# Altium project ALU_Shifter.PrjPcb
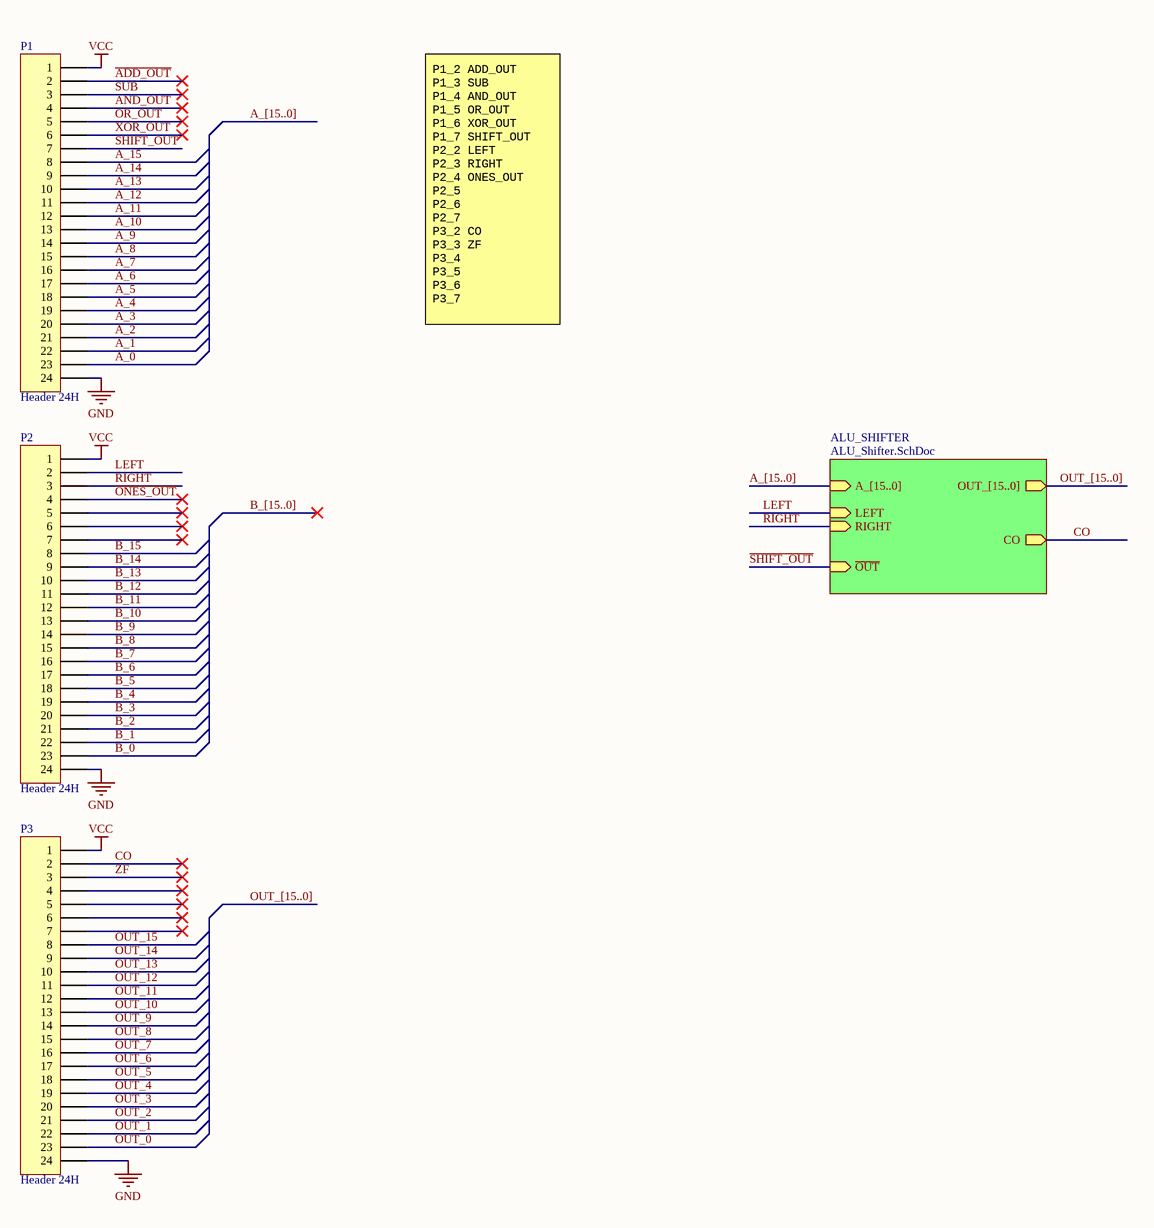
[diagram p0: Connectors.SchDoc]
2 sheets, 17 parts. Net scope: hierarchical (ports join the sheet entries above them; power ports are global).
Board file: ALU_Shifter.PcbDoc
Sheets:
  Connectors.SchDoc
    ALU_SHIFTER = ALU_Shifter.SchDoc

## Sheet Connectors.SchDoc
size B; Author: E. Sims; Organization: Let's Build Rockets Inc.; SheetNumber: 1; SheetTotal: 2

### Parts
P1  Header 24H  [HDR1X24H]
P2  Header 24H  [HDR1X24H]
P3  Header 24H  [HDR1X24H]

### Sub-sheets
ALU_SHIFTER = ALU_Shifter.SchDoc: ~{OUT} (in), OUT_[15..0] (out), A_[15..0] (in), CO (out), LEFT (in), RIGHT (in)

### Nets
GND: P1.24 P2.24 P3.24
VCC: P1.1 P2.1 P3.1
~{ADD_OUT}: P1.2
~{AND_OUT}: P1.4
A_0: P1.23
A_1: P1.22
A_2: P1.21
A_3: P1.20
A_4: P1.19
A_5: P1.18
A_6: P1.17
A_7: P1.16
A_8: P1.15
A_9: P1.14
A_10: P1.13
A_11: P1.12
A_12: P1.11
A_13: P1.10
A_14: P1.9
A_15: P1.8
B_0: P2.23
B_1: P2.22
B_2: P2.21
B_3: P2.20
B_4: P2.19
B_5: P2.18
B_6: P2.17
B_7: P2.16
B_8: P2.15
B_9: P2.14
B_10: P2.13
B_11: P2.12
B_12: P2.11
B_13: P2.10
B_14: P2.9
B_15: P2.8
CO: P3.2 ; sheet ALU_SHIFTER/CO
LEFT: P2.2 ; sheet ALU_SHIFTER/LEFT
~{ONES_OUT}: P2.4
~{OR_OUT}: P1.5
OUT_0: P3.23
OUT_1: P3.22
OUT_2: P3.21
OUT_3: P3.20
OUT_4: P3.19
OUT_5: P3.18
OUT_6: P3.17
OUT_7: P3.16
OUT_8: P3.15
OUT_9: P3.14
OUT_10: P3.13
OUT_11: P3.12
OUT_12: P3.11
OUT_13: P3.10
OUT_14: P3.9
OUT_15: P3.8
RIGHT: P2.3 ; sheet ALU_SHIFTER/RIGHT
~{SHIFT_OUT}: P1.7 ; sheet ALU_SHIFTER/~{OUT}  [project net ~{OUT}]
SUB: P1.3
~{XOR_OUT}: P1.6
~{ZF}: P3.3

Not connected (* = marked no-connect by the designer): P2 5* 6* 7*; P3 4* 5* 6* 7*

### Buses and harness runs
bus A_[15..0]
bus A_[15..0] = sheet ALU_SHIFTER/A_[15..0]
bus B_[15..0]
bus OUT_[15..0]
bus OUT_[15..0] = sheet ALU_SHIFTER/OUT_[15..0]

### Notes on the sheet
- P1_2 ADD_OUT
  P1_3 SUB
  P1_4 AND_OUT
  P1_5 OR_OUT
  P1_6 XOR_OUT
  P1_7 SHIFT_OUT
  P2_2 LEFT
  P2_3 RIGHT
  P2_4 ONES_OUT
  P2_5
  P2_6
  P2_7
  P3_2 CO
  P3_3 ZF
  P3_4
  P3_5
  P3_6
  P3_7
- Let's Build Rocket's Inc. Modular Paylaod System Based on TMP-010 Rev
  For more information visit https://github.com/LetsBuildRockets/Modular-Payload-System
  This work is licensed under CC BY-NC 4.0. To view a copy of this license, visit https://creativecommons.org/licenses/by-nc/4.0
- Title
- Size:
- Date:
- Assembly Variant:
- B
- Number:
- Time:
- Revision:
- Sheet
- of
- Author:
- File:

### Library data of the parts
P1-P3 = Header 24H: Header, 24-Pin, Right Angle; LatestRevisionDate: 17-Jul-2002; LatestRevisionNote: Re-released for DXP Platform.; Publisher: Altium Limited

## Sheet ALU_Shifter.SchDoc
size B; Author: E. Sims; Organization: Let's Build Rockets Inc.; SheetNumber: 15; SheetTotal: 16
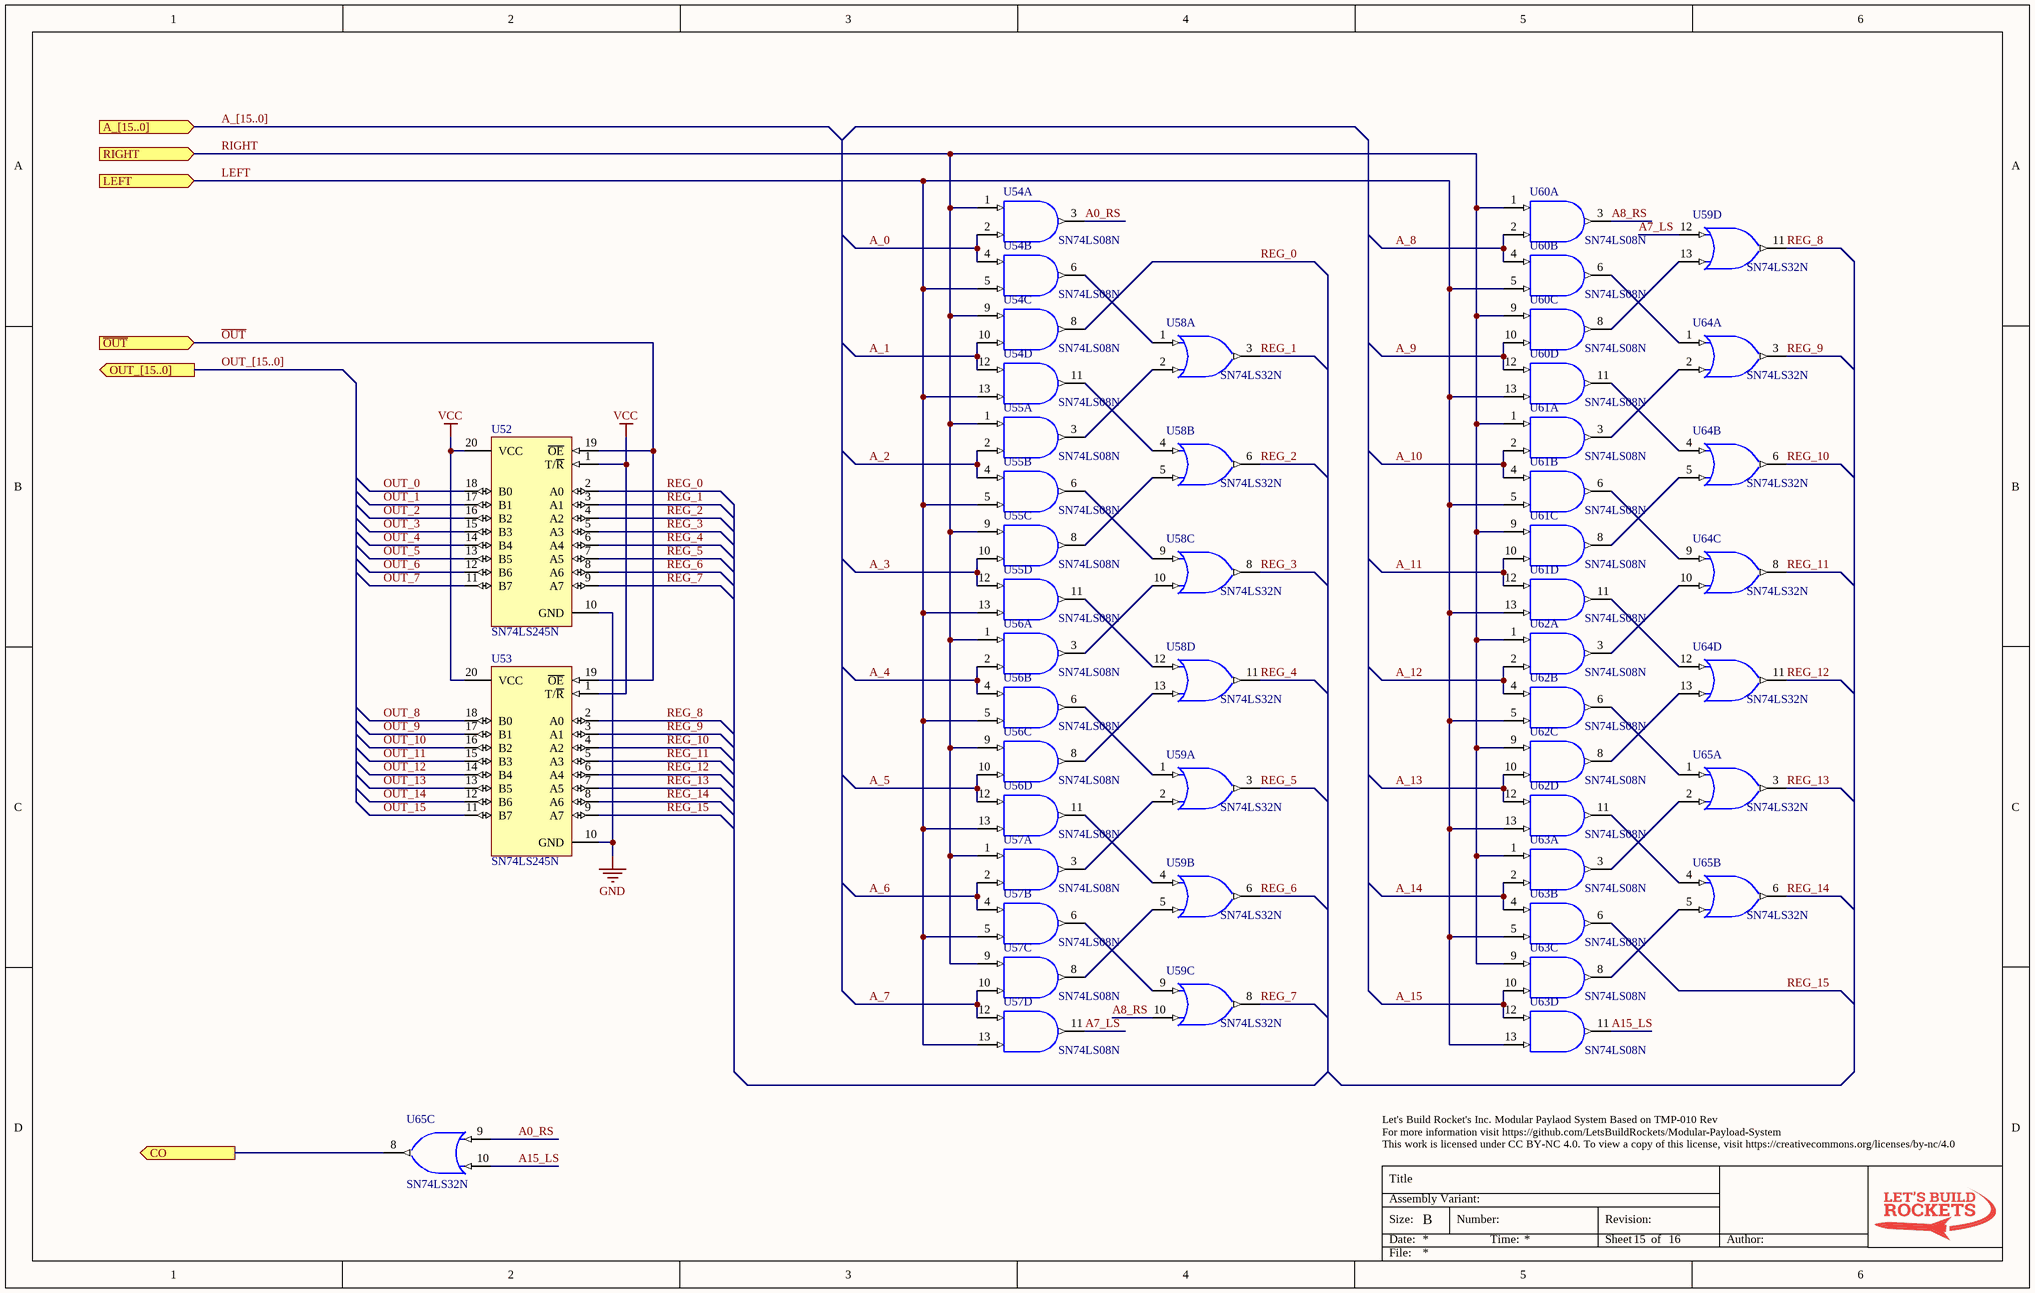
[diagram p1: ALU_Shifter.SchDoc]

### Parts
U52  SN74LS245N  [N020]
U53  SN74LS245N  [N020]
U54  SN74LS08N  [N014]  (parts A,B,C,D of 4)
U55  SN74LS08N  [N014]  (parts A,B,C,D of 4)
U56  SN74LS08N  [N014]  (parts A,B,C,D of 4)
U57  SN74LS08N  [N014]  (parts A,B,C,D of 4)
U58  SN74LS32N  [N014]  (parts A,B,C,D of 4)
U59  SN74LS32N  [N014]  (parts A,B,C,D of 4)
U60  SN74LS08N  [N014]  (parts A,B,C,D of 4)
U61  SN74LS08N  [N014]  (parts A,B,C,D of 4)
U62  SN74LS08N  [N014]  (parts A,B,C,D of 4)
U63  SN74LS08N  [N014]  (parts A,B,C,D of 4)
U64  SN74LS32N  [N014]  (parts A,B,C,D of 4)
U65  SN74LS32N  [N014]  (parts A,B,C of 4)

### Ports
A_[15..0] (in), CO (out), LEFT (in), OUT_[15..0] (out), RIGHT (in), ~{OUT} (in)

### Nets
GND: U52.10(GND) U53.10(GND) U54.7(GND) U55.7(GND) U56.7(GND) U57.7(GND) U58.7(GND) U59.7(GND) U60.7(GND) U61.7(GND) U62.7(GND) U63.7(GND) U64.7(GND) U65.7(GND)
VCC: U52.1(T/~{R}) U52.20(VCC) U53.1(T/~{R}) U53.20(VCC) U54.14(VCC) U55.14(VCC) U56.14(VCC) U57.14(VCC) U58.14(VCC) U59.14(VCC) U60.14(VCC) U61.14(VCC) U62.14(VCC) U63.14(VCC) U64.14(VCC) U65.14(VCC)
A0_RS: U54.3(Y) U65.9(A)
A7_LS: U57.11(Y) U59.12(A)
A8_RS: U59.10(B) U60.3(Y)
A15_LS: U63.11(Y) U65.10(B)
A_0: U54.2(B) U54.4(A)
A_1: U54.10(B) U54.12(A)
A_2: U55.2(B) U55.4(A)
A_3: U55.10(B) U55.12(A)
A_4: U56.2(B) U56.4(A)
A_5: U56.10(B) U56.12(A)
A_6: U57.2(B) U57.4(A)
A_7: U57.10(B) U57.12(A)
A_8: U60.2(B) U60.4(A)
A_9: U60.10(B) U60.12(A)
A_10: U61.2(B) U61.4(A)
A_11: U61.10(B) U61.12(A)
A_12: U62.2(B) U62.4(A)
A_13: U62.10(B) U62.12(A)
A_14: U63.2(B) U63.4(A)
A_15: U63.10(B) U63.12(A)
CO: U65.8(Y) ; port CO
LEFT: U54.5(B) U54.13(B) U55.5(B) U55.13(B) U56.5(B) U56.13(B) U57.5(B) U57.13(B) U60.5(B) U60.13(B) U61.5(B) U61.13(B) U62.5(B) U62.13(B) U63.5(B) U63.13(B) ; port LEFT
~{OUT}: U52.19(~{OE}) U53.19(~{OE}) ; port ~{OUT}
OUT_0: U52.18(B0)
OUT_1: U52.17(B1)
OUT_2: U52.16(B2)
OUT_3: U52.15(B3)
OUT_4: U52.14(B4)
OUT_5: U52.13(B5)
OUT_6: U52.12(B6)
OUT_7: U52.11(B7)
OUT_8: U53.18(B0)
OUT_9: U53.17(B1)
OUT_10: U53.16(B2)
OUT_11: U53.15(B3)
OUT_12: U53.14(B4)
OUT_13: U53.13(B5)
OUT_14: U53.12(B6)
OUT_15: U53.11(B7)
REG_0: U52.2(A0) U54.8(Y)
REG_1: U52.3(A1) U58.3(Y)
REG_2: U52.4(A2) U58.6(Y)
REG_3: U52.5(A3) U58.8(Y)
REG_4: U52.6(A4) U58.11(Y)
REG_5: U52.7(A5) U59.3(Y)
REG_6: U52.8(A6) U59.6(Y)
REG_7: U52.9(A7) U59.8(Y)
REG_8: U53.2(A0) U59.11(Y)
REG_9: U53.3(A1) U64.3(Y)
REG_10: U53.4(A2) U64.6(Y)
REG_11: U53.5(A3) U64.8(Y)
REG_12: U53.6(A4) U64.11(Y)
REG_13: U53.7(A5) U65.3(Y)
REG_14: U53.8(A6) U65.6(Y)
REG_15: U53.9(A7) U63.6(Y)
RIGHT: U54.1(A) U54.9(A) U55.1(A) U55.9(A) U56.1(A) U56.9(A) U57.1(A) U57.9(A) U60.1(A) U60.9(A) U61.1(A) U61.9(A) U62.1(A) U62.9(A) U63.1(A) U63.9(A) ; port RIGHT
NetU54_6: U54.6(Y) U58.1(A)
NetU54_11: U54.11(Y) U58.4(A)
NetU55_3: U55.3(Y) U58.2(B)
NetU55_6: U55.6(Y) U58.9(A)
NetU55_8: U55.8(Y) U58.5(B)
NetU55_11: U55.11(Y) U58.12(A)
NetU56_3: U56.3(Y) U58.10(B)
NetU56_6: U56.6(Y) U59.1(A)
NetU56_8: U56.8(Y) U58.13(B)
NetU56_11: U56.11(Y) U59.4(A)
NetU57_3: U57.3(Y) U59.2(B)
NetU57_6: U57.6(Y) U59.9(A)
NetU57_8: U57.8(Y) U59.5(B)
NetU59_13: U59.13(B) U60.8(Y)
NetU60_6: U60.6(Y) U64.1(A)
NetU60_11: U60.11(Y) U64.4(A)
NetU61_3: U61.3(Y) U64.2(B)
NetU61_6: U61.6(Y) U64.9(A)
NetU61_8: U61.8(Y) U64.5(B)
NetU61_11: U61.11(Y) U64.12(A)
NetU62_3: U62.3(Y) U64.10(B)
NetU62_6: U62.6(Y) U65.1(A)
NetU62_8: U62.8(Y) U64.13(B)
NetU62_11: U62.11(Y) U65.4(A)
NetU63_3: U63.3(Y) U65.2(B)
NetU63_8: U63.8(Y) U65.5(B)

### Buses and harness runs
bus A_[15..0] = port A_[15..0]
bus OUT_[15..0] = port OUT_[15..0]

### Notes on the sheet
- Let's Build Rocket's Inc. Modular Paylaod System Based on TMP-010 Rev
  For more information visit https://github.com/LetsBuildRockets/Modular-Payload-System
  This work is licensed under CC BY-NC 4.0. To view a copy of this license, visit https://creativecommons.org/licenses/by-nc/4.0
- Title
- Size:
- Date:
- Assembly Variant:
- B
- Number:
- Time:
- Revision:
- Sheet
- of
- Author:
- File:

### Library data of the parts
U52 U53 = SN74LS245N: Octal Bus Transceiver with 3-State Outputs; Published: 8-Jun-2000; LatestRevisionDate: 04-Mar-2005; LatestRevisionNote: Stylized 3D Model Added.; DatasheetVersion: Mar-1988; PackageVersion: Oct-1995; PackageReference: N020; Publisher: Altium Limited; PackageDescription: DIP; 20 Leads; Row Spacing 7.62 mm; Pitch 2.54 mm; ComponentLink1Description: Manufacturer Link; ComponentLink1URL: http://www.ti.com/; ComponentLink2Description: Datasheet; ComponentLink2URL: http://www-s.ti.com/sc/ds/sn74ls245.pdf
U54-U57 U60-U63 = SN74LS08N: Quadruple 2-Input Positive-AND Gate; Published: 8-Jun-2000; LatestRevisionDate: 04-Mar-2005; LatestRevisionNote: Stylized 3D Model Added.; DatasheetVersion: Mar-1988; PackageVersion: Oct-1995; PackageReference: N014; Publisher: Altium Limited; PackageDescription: DIP; 14 Leads; Row Spacing 7.62 mm; Pitch 2.54 mm; ComponentLink1Description: Manufacturer Link; ComponentLink1URL: http://www.ti.com/; ComponentLink2Description: Datasheet; ComponentLink2URL: http://www-s.ti.com/sc/ds/SN74LS08.pdf
U58 U59 U64 U65 = SN74LS32N: Quadruple 2-Input Positive-OR Gate; Published: 8-Jun-2000; LatestRevisionDate: 04-Mar-2005; LatestRevisionNote: Stylized 3D Model Added.; DatasheetVersion: Mar-1988; PackageVersion: Oct-1995; PackageReference: N014; Publisher: Altium Limited; PackageDescription: DIP; 14 Leads; Row Spacing 7.62 mm; Pitch 2.54 mm; ComponentLink1Description: Manufacturer Link; ComponentLink1URL: http://www.ti.com/; ComponentLink2Description: Datasheet; ComponentLink2URL: http://www-s.ti.com/sc/ds/sn74ls32.pdf

## Nets that join several sheets
GND: Connectors (P1.24 P2.24 P3.24), ALU_Shifter (14 pins)
VCC: Connectors (P1.1 P2.1 P3.1), ALU_Shifter (16 pins)
A_0: Connectors (P1.23), ALU_Shifter (U54.2 U54.4)
A_1: Connectors (P1.22), ALU_Shifter (U54.10 U54.12)
A_2: Connectors (P1.21), ALU_Shifter (U55.2 U55.4)
A_3: Connectors (P1.20), ALU_Shifter (U55.10 U55.12)
A_4: Connectors (P1.19), ALU_Shifter (U56.2 U56.4)
A_5: Connectors (P1.18), ALU_Shifter (U56.10 U56.12)
A_6: Connectors (P1.17), ALU_Shifter (U57.2 U57.4)
A_7: Connectors (P1.16), ALU_Shifter (U57.10 U57.12)
A_8: Connectors (P1.15), ALU_Shifter (U60.2 U60.4)
A_9: Connectors (P1.14), ALU_Shifter (U60.10 U60.12)
A_10: Connectors (P1.13), ALU_Shifter (U61.2 U61.4)
A_11: Connectors (P1.12), ALU_Shifter (U61.10 U61.12)
A_12: Connectors (P1.11), ALU_Shifter (U62.2 U62.4)
A_13: Connectors (P1.10), ALU_Shifter (U62.10 U62.12)
A_14: Connectors (P1.9), ALU_Shifter (U63.2 U63.4)
A_15: Connectors (P1.8), ALU_Shifter (U63.10 U63.12)
CO: Connectors (P3.2), ALU_Shifter (U65.8)
LEFT: Connectors (P2.2), ALU_Shifter (16 pins)
~{OUT}: Connectors (P1.7), ALU_Shifter (U52.19 U53.19)
OUT_0: Connectors (P3.23), ALU_Shifter (U52.18)
OUT_1: Connectors (P3.22), ALU_Shifter (U52.17)
OUT_2: Connectors (P3.21), ALU_Shifter (U52.16)
OUT_3: Connectors (P3.20), ALU_Shifter (U52.15)
OUT_4: Connectors (P3.19), ALU_Shifter (U52.14)
OUT_5: Connectors (P3.18), ALU_Shifter (U52.13)
OUT_6: Connectors (P3.17), ALU_Shifter (U52.12)
OUT_7: Connectors (P3.16), ALU_Shifter (U52.11)
OUT_8: Connectors (P3.15), ALU_Shifter (U53.18)
OUT_9: Connectors (P3.14), ALU_Shifter (U53.17)
OUT_10: Connectors (P3.13), ALU_Shifter (U53.16)
OUT_11: Connectors (P3.12), ALU_Shifter (U53.15)
OUT_12: Connectors (P3.11), ALU_Shifter (U53.14)
OUT_13: Connectors (P3.10), ALU_Shifter (U53.13)
OUT_14: Connectors (P3.9), ALU_Shifter (U53.12)
OUT_15: Connectors (P3.8), ALU_Shifter (U53.11)
RIGHT: Connectors (P2.3), ALU_Shifter (16 pins)